# EAGLE design tailbrake (EAGLE 6.4)
LED tail/brake light replacement
Assembly variants: Simple, Dimmed
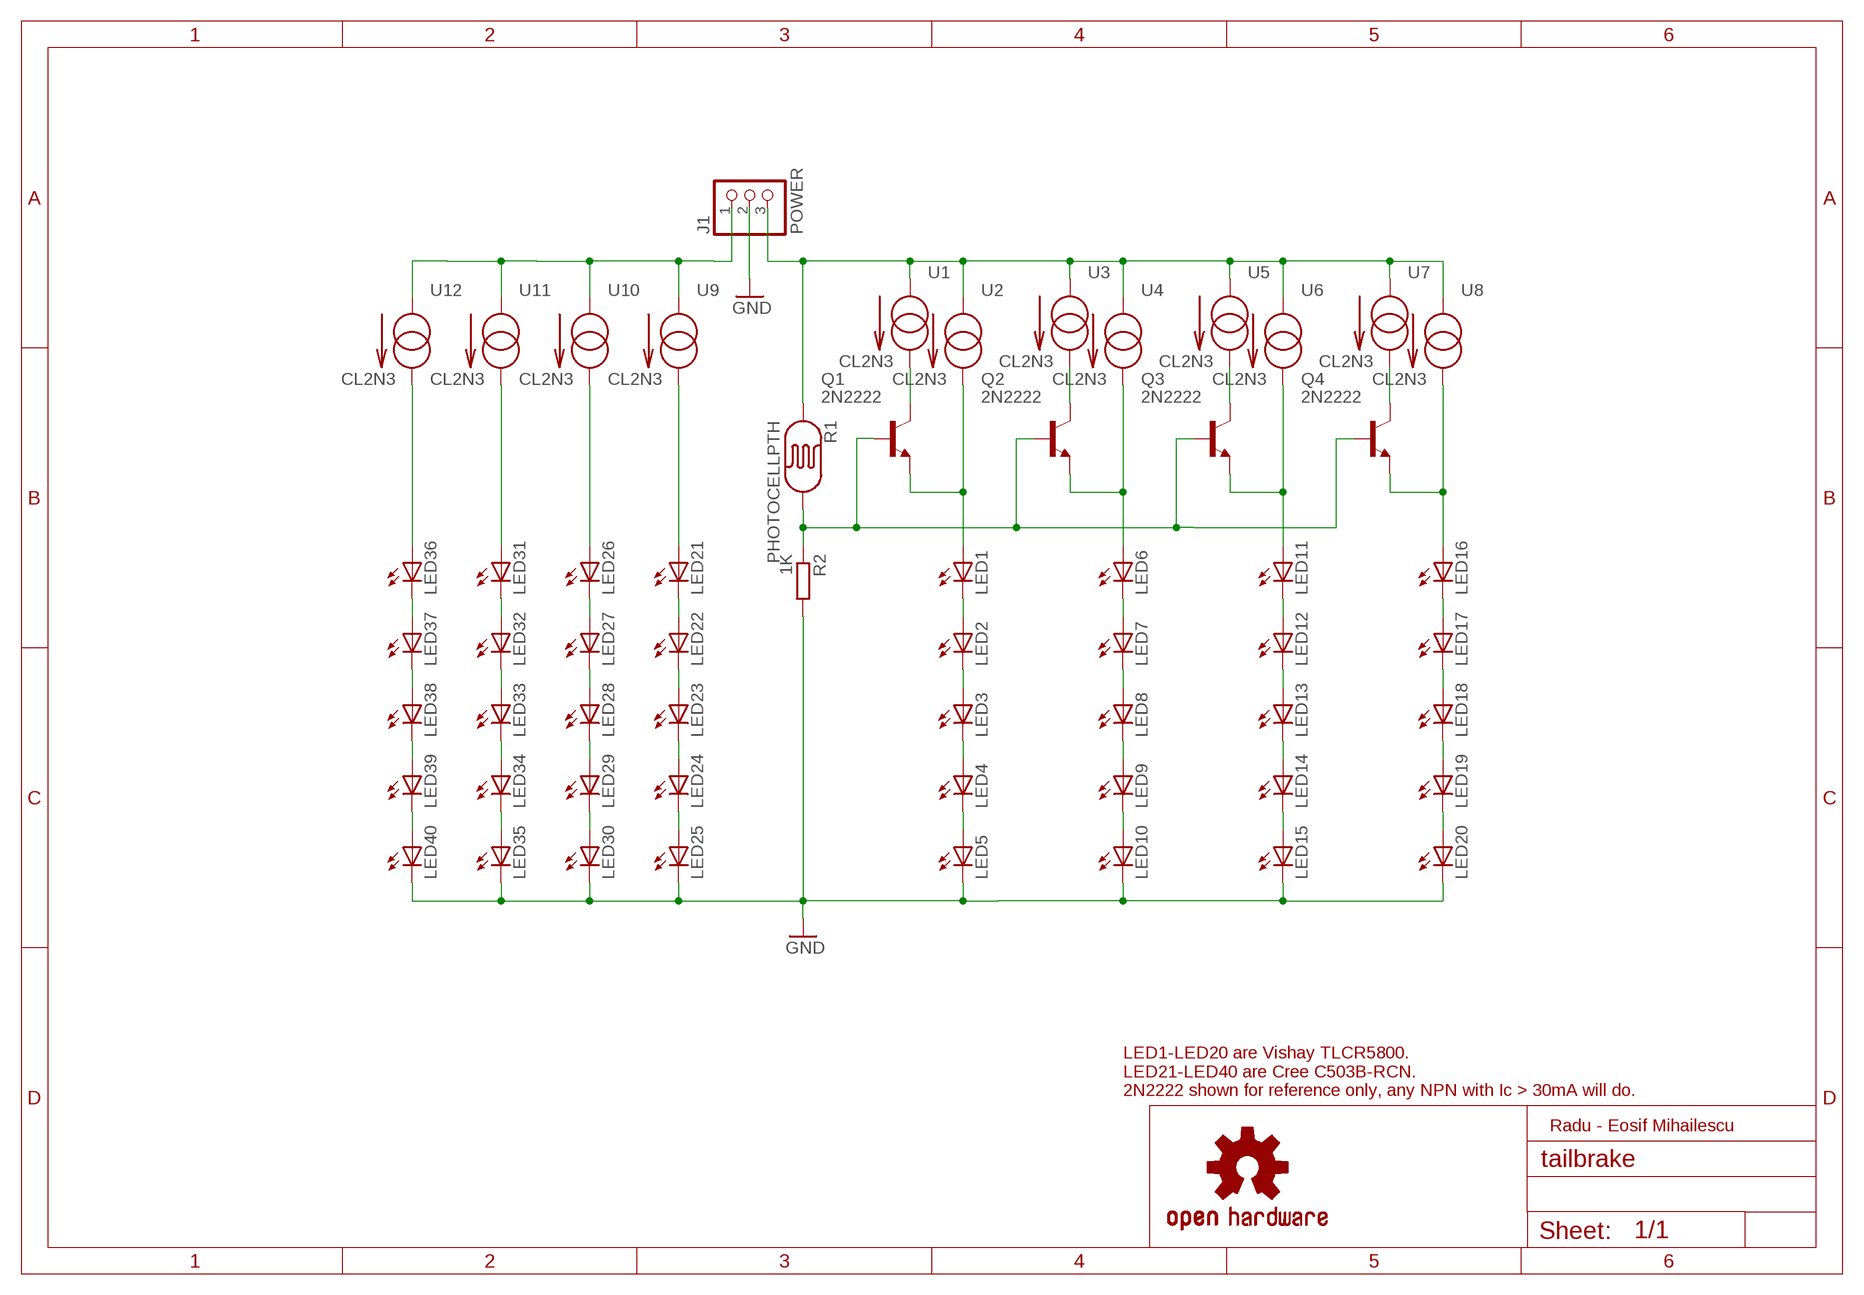
[diagram p0: schematic, sheet 1]

## Parts
J1  POWER  PINHD-1X3/90  [1X03/90]
LED1  LED5MM  [LED5MM]
LED2  LED5MM  [LED5MM]
LED3  LED5MM  [LED5MM]
LED4  LED5MM  [LED5MM]
LED5  LED5MM  [LED5MM]
LED6  LED5MM  [LED5MM]
LED7  LED5MM  [LED5MM]
LED8  LED5MM  [LED5MM]
LED9  LED5MM  [LED5MM]
LED10  LED5MM  [LED5MM]
LED11  LED5MM  [LED5MM]
LED12  LED5MM  [LED5MM]
LED13  LED5MM  [LED5MM]
LED14  LED5MM  [LED5MM]
LED15  LED5MM  [LED5MM]
LED16  LED5MM  [LED5MM]
LED17  LED5MM  [LED5MM]
LED18  LED5MM  [LED5MM]
LED19  LED5MM  [LED5MM]
LED20  LED5MM  [LED5MM]
LED21  LED5MM  [LED5MM]
LED22  LED5MM  [LED5MM]
LED23  LED5MM  [LED5MM]
LED24  LED5MM  [LED5MM]
LED25  LED5MM  [LED5MM]
LED26  LED5MM  [LED5MM]
LED27  LED5MM  [LED5MM]
LED28  LED5MM  [LED5MM]
LED29  LED5MM  [LED5MM]
LED30  LED5MM  [LED5MM]
LED31  LED5MM  [LED5MM]
LED32  LED5MM  [LED5MM]
LED33  LED5MM  [LED5MM]
LED34  LED5MM  [LED5MM]
LED35  LED5MM  [LED5MM]
LED36  LED5MM  [LED5MM]
LED37  LED5MM  [LED5MM]
LED38  LED5MM  [LED5MM]
LED39  LED5MM  [LED5MM]
LED40  LED5MM  [LED5MM]
LOGO1  OSHW-LOGOL  [OSHW-LOGO-L]
Q1  2N2222  2N2222-NPN-TO92-EBC  [TO92-EBC]  (not fitted in variant Simple)
Q2  2N2222  2N2222-NPN-TO92-EBC  [TO92-EBC]  (not fitted in variant Simple)
Q3  2N2222  2N2222-NPN-TO92-EBC  [TO92-EBC]  (not fitted in variant Simple)
Q4  2N2222  2N2222-NPN-TO92-EBC  [TO92-EBC]  (not fitted in variant Simple)
R1  PHOTOCELLPTH  [PHOTOCELL]  (not fitted in variant Simple)
R2  1K  R-EU_0204/7  [0204/7]  (not fitted in variant Simple)
U1  CL2N3  [TO-92]
U2  CL2N3  [TO-92]
U3  CL2N3  [TO-92]
U4  CL2N3  [TO-92]
U5  CL2N3  [TO-92]
U6  CL2N3  [TO-92]
U7  CL2N3  [TO-92]
U8  CL2N3  [TO-92]
U9  CL2N3  [TO-92]
U10  CL2N3  [TO-92]
U11  CL2N3  [TO-92]
U12  CL2N3  [TO-92]

## Nets
BRAKE [power]: J1.3 R1.1 U1.1(IN) U2.1(IN) U3.1(IN) U4.1(IN) U5.1(IN) U6.1(IN) U7.1(IN) U8.1(IN)
GND [power]: J1.2 LED5.K(C) LED10.K(C) LED15.K(C) LED20.K(C) LED25.K(C) LED30.K(C) LED35.K(C) LED40.K(C) R2.2
N$1 [power]: LED1.K(C) LED2.A
N$2 [power]: LED2.K(C) LED3.A
N$3 [power]: LED3.K(C) LED4.A
N$4 [power]: LED1.A Q1.E U2.3(OUT)
N$5 [power]: LED4.K(C) LED5.A
N$6 [power]: Q1.C U1.3(OUT)
N$7 [power]: Q2.C U3.3(OUT)
N$8 [power]: LED6.K(C) LED7.A
N$9 [power]: LED7.K(C) LED8.A
N$10 [power]: LED8.K(C) LED9.A
N$11 [power]: LED6.A Q2.E U4.3(OUT)
N$12 [power]: LED9.K(C) LED10.A
N$13 [power]: Q3.C U5.3(OUT)
N$14 [power]: LED11.K(C) LED12.A
N$15 [power]: LED12.K(C) LED13.A
N$16 [power]: LED13.K(C) LED14.A
N$17 [power]: LED11.A Q3.E U6.3(OUT)
N$18 [power]: LED14.K(C) LED15.A
N$19 [power]: LED16.K(C) LED17.A
N$20 [power]: LED17.K(C) LED18.A
N$21 [power]: LED18.K(C) LED19.A
N$22 [power]: LED16.A Q4.E U8.3(OUT)
N$23 [power]: LED19.K(C) LED20.A
N$24 [power]: Q4.C U7.3(OUT)
N$26 [power]: LED21.K(C) LED22.A
N$27 [power]: LED22.K(C) LED23.A
N$28 [power]: LED23.K(C) LED24.A
N$29 [power]: LED21.A U9.3(OUT)
N$30 [power]: LED24.K(C) LED25.A
N$31 [power]: LED26.K(C) LED27.A
N$32 [power]: LED27.K(C) LED28.A
N$33 [power]: LED28.K(C) LED29.A
N$34 [power]: LED26.A U10.3(OUT)
N$35 [power]: LED29.K(C) LED30.A
N$36 [power]: LED31.K(C) LED32.A
N$37 [power]: LED32.K(C) LED33.A
N$38 [power]: LED33.K(C) LED34.A
N$39 [power]: LED31.A U11.3(OUT)
N$40 [power]: LED34.K(C) LED35.A
N$41 [power]: LED36.K(C) LED37.A
N$42 [power]: LED37.K(C) LED38.A
N$43 [power]: LED38.K(C) LED39.A
N$44 [power]: LED36.A U12.3(OUT)
N$45 [power]: LED39.K(C) LED40.A
SENSE [signal]: Q1.B Q2.B Q3.B Q4.B R1.2 R2.1
TAIL [power]: J1.1 U9.1(IN) U10.1(IN) U11.1(IN) U12.1(IN)

## Notes on the sheet
- LED1-LED20 are Vishay TLCR5800.
  LED21-LED40 are Cree C503B-RCN.
  2N2222 shown for reference only, any NPN with Ic > 30mA will do.
- Radu - Eosif Mihailescu

## Library data of the parts
J1 = pinhead:PINHD-1X3: PIN HEADER
LED1-LED40 = led:LED: LED OSRAM: - CHIPLED LG R971, LG N971, LY N971, LG Q971, LY Q971, LO R971, LY R971 LH N974, LH R974 LS Q976, LO Q976, LY Q976 LO Q996 - Hyper CHIPLED LW Q18S LB Q993, LB Q99A, LB R99A - SideLED LS A670, LO A670, LY A670, LG A670, LP A670 LB A673, LV A673, LT A673, LW A673 LH A674 LY A675 LS A676, LA A676, LO A676, LY A676, LW A676 LS A679, LY A679, LG A679 - Hyper Micro SIDELED® LS Y876, LA Y876, LO Y876, LY Y876 LT Y87S - SmartLED LW L88C, LW L88S LB L89C, LB L89S, LG L890 LS L89K, LO L89K, LY L89K LS L896, LA L896, LO L896, LY L896 - TOPLED LS T670, LO T670, LY T670, LG T670, LP T670 LSG T670, LSP T670, LSY T670, LOP T670, LYG T670 LG T671, LOG T671, LSG T671 LB T673, LV T673, LT T673, LW T673 LH T674 LS T676, LA T676, LO T676, LY T676, LB T676, LH T676, LSB T676, LW T676 LB T67C, LV T67C, LT T67C, LS T67K, LO T67K, LY T67K, LW E67C LS E67B, LA E67B, LO E67B, LY E67B, LB E67C, LV E67C, LT E67C LW T67C LS T679, LY T679, LG T679 LS T770, LO T770, LY T770, LG T770, LP T770 LB T773, LV T773, LT T773, LW T773 LH T774 LS E675, LA E675, LY E675, LS T675 LS T776, LA T776, LO T776, LY T776, LB T776 LHGB T686 LT T68C, LB T68C - Hyper Mini TOPLED® LB M676 - Mini TOPLED Santana® LG M470 LS M47K, LO M47K, LY M47K Source: http://www.osram.convergy.de LUXEON: - LUMILED® LXK2-PW12-R00, LXK2-PW12-S00, LXK2-PW14-U00, LXK2-PW14-V00 LXK2-PM12-R00, LXK2-PM12-S00, LXK2-PM14-U00 LXK2-PE12-Q00, LXK2-PE12-R00, LXK2-PE12-S00, LXK2-PE14-T00, LXK2-PE14-U00 LXK2-PB12-K00, LXK2-PB12-L00, LXK2-PB12-M00, LXK2-PB14-N00, LXK2-PB14-P00, LXK2-PB14-Q00 LXK2-PR12-L00, LXK2-PR12-M00, LXK2-PR14-Q00, LXK2-PR14-R00 LXK2-PD12-Q00, LXK2-PD12-R00, LXK2-PD12-S00 LXK2-PH12-R00, LXK2-PH12-S00 LXK2-PL12-P00, LXK2-PL12-Q00, LXK2-PL12-R00 Source: www.luxeon.com KINGBRIGHT: KA-3528ASYC Source: www.kingbright.com
LOGO1 = SparkFun-Aesthetics:OSHW-LOGO: Open Source Hardware Logo This logo indicates the piece of hardware it is found on incorporates a OSHW license and/or adheres to the definition of open source hardware found here: http://freedomdefined.org/OSHW
Q1-Q4 = transistor-neu-to92:*-NPN-: NPN Transistror
R1 = SparkFun-Sensors:PHOTOCELL: CdS photoresistor. This is a low cost way to detect light levels. Resistance decreases with more incoming light. SparkFun SKU: SEN-09088
R2 = rcl:R-EU_: RESISTOR, European symbol
U1-U12 = radu-collected:CL2*: Supertex CL2 20mA thermocompensated constant current source for driving LEDs

## Net classes
0 default: clearance 0.355 mm
1 power: width 1.27 mm, clearance 0.508 mm
2 signal: width 0.254 mm, clearance 0.254 mm

## Board
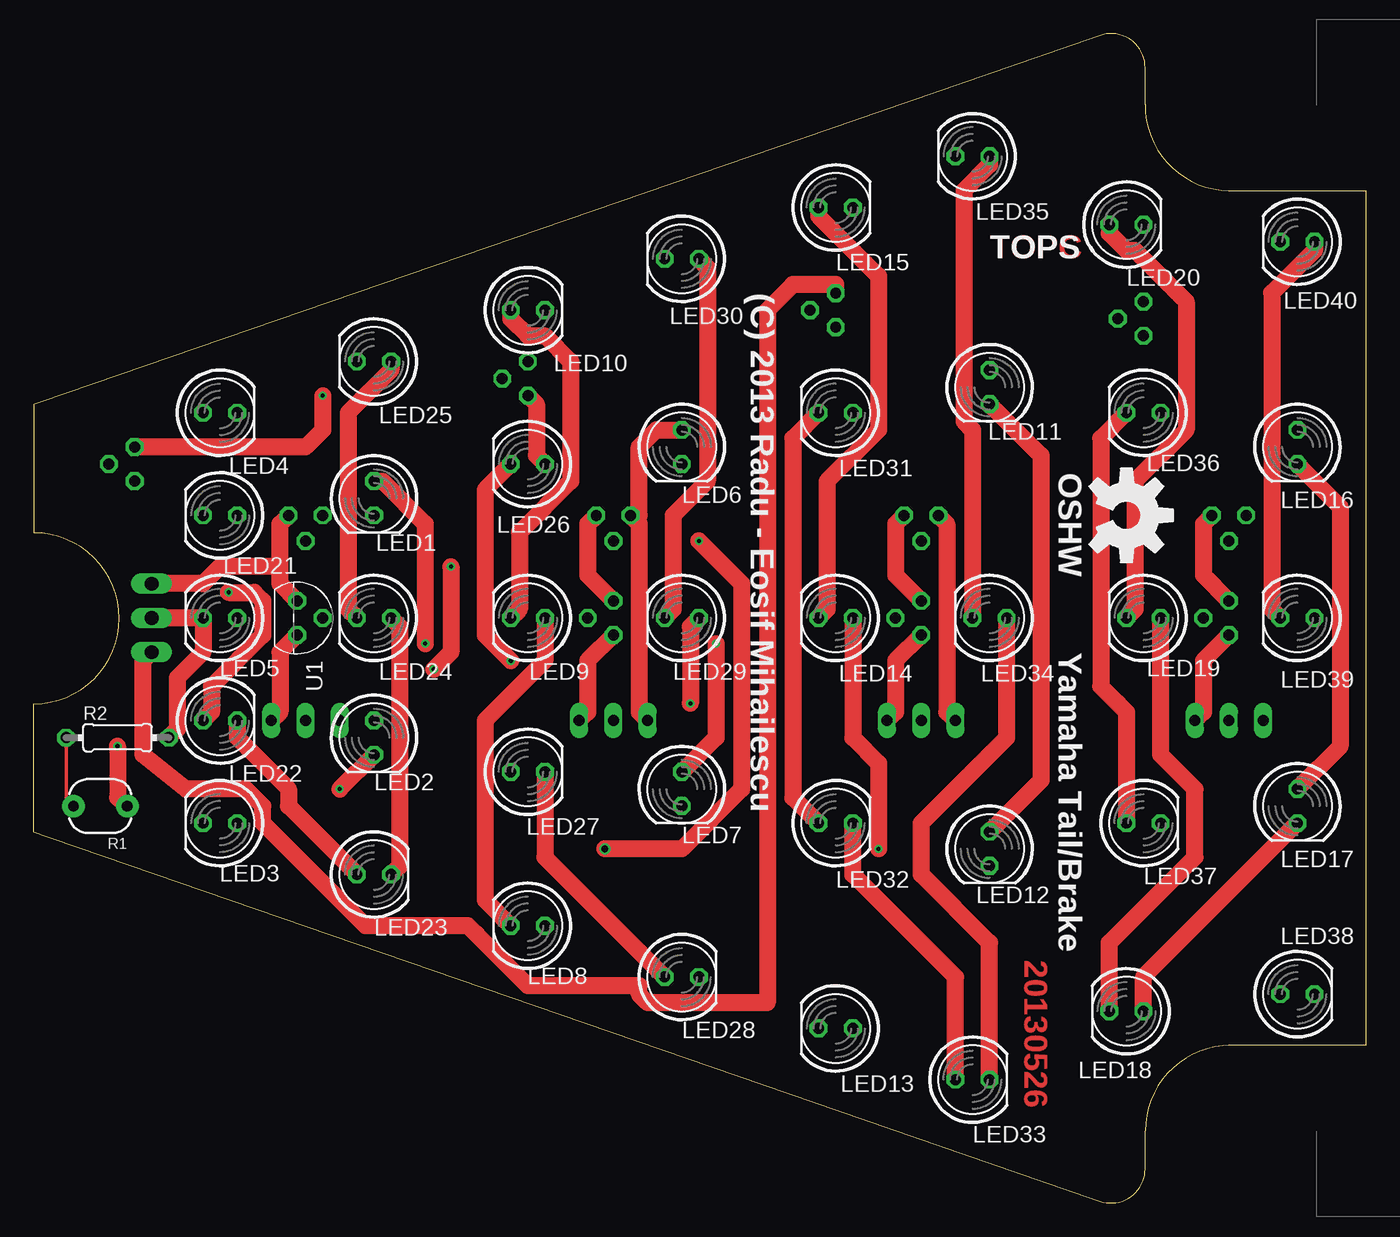
[diagram p1: board, top side]
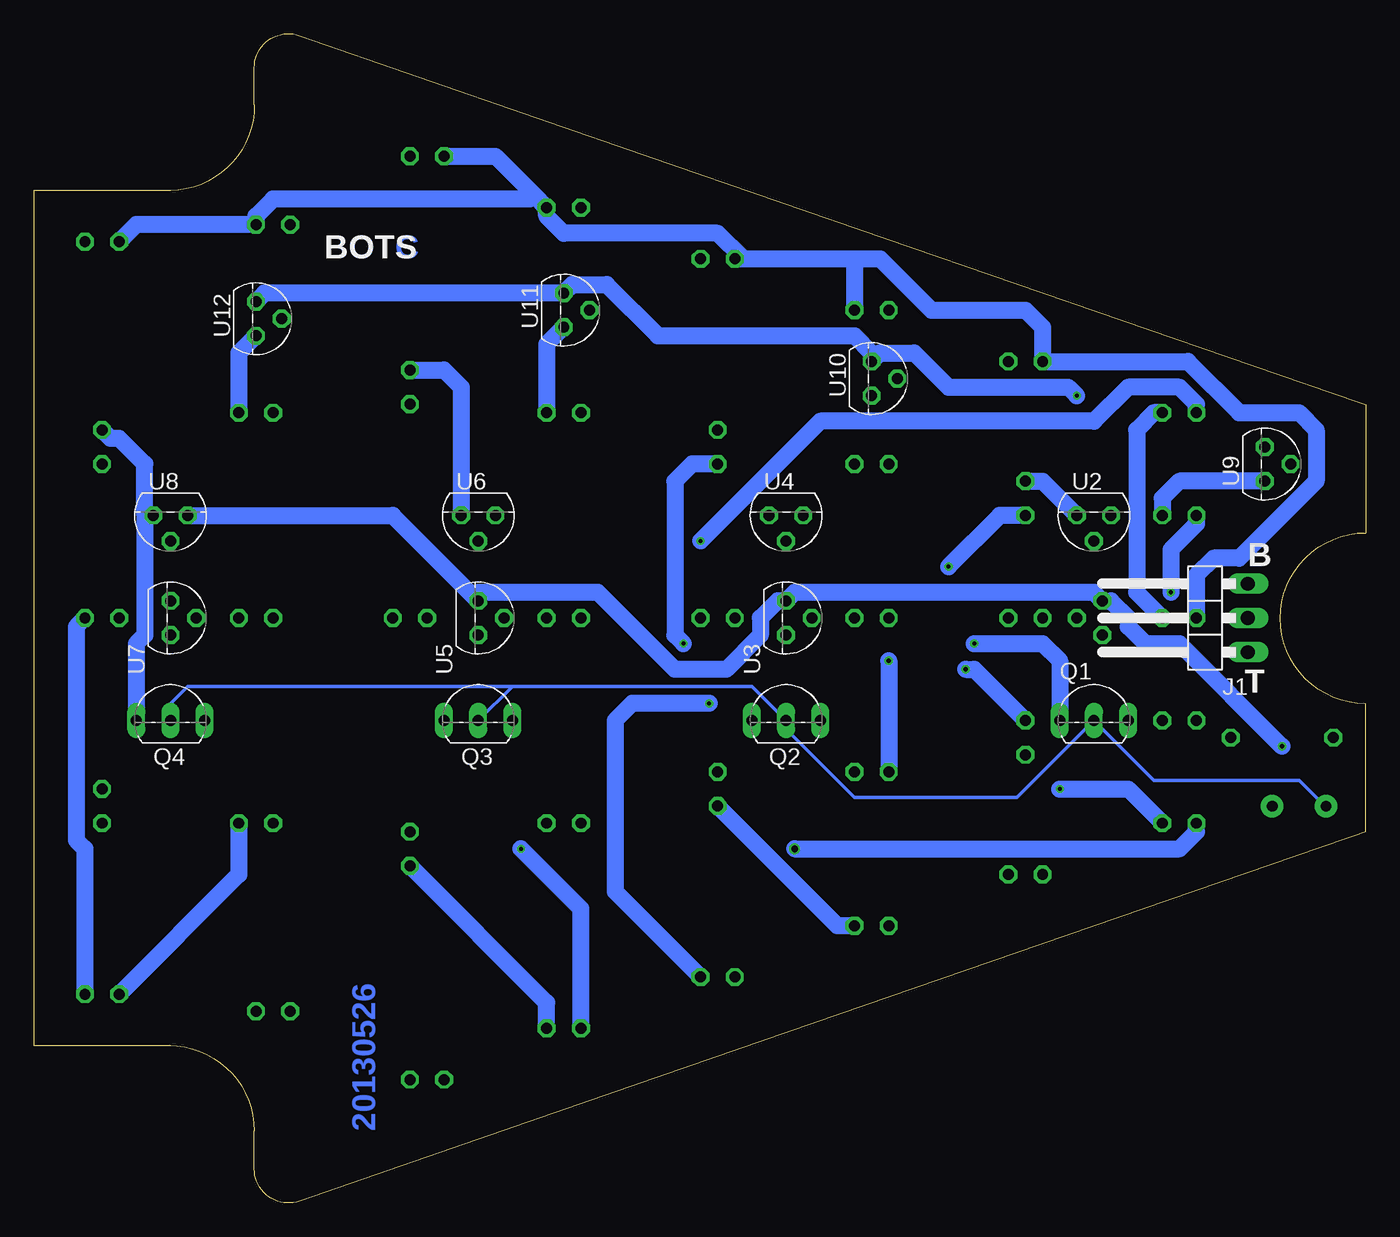
[diagram p2: board, bottom side, seen from below]

Size 98.93 x 86.84 mm. Coordinates in mm from the lower left corner, seen from the top.
Outline: 88.9,11.7 arc90 82.55,5.35 82.55,2.54 arc-109 79.18,0.14 0,27.55 0,37.07 arc180 0,49.77 0,59.3 79.18,86.7 arc-109 82.55,84.3 82.55,81.55 arc90 88.77,75.2 98.93,75.2 98.93,11.7 88.9,11.7
Outline: 88.9,11.7 88.77,11.7
Copper layers (1*16): Top 0.035mm / dielectric 1.5mm / Bottom 0.035mm
Design rules "ITEADstudio_DRC": minimum track width 10mil, minimum drill 12mil, track to track 10mil, track to pad 10mil, pad to pad 10mil, via to via 10mil, smd to smd 0mil, copper to edge 20mil, drill to drill 10mil, minimum pad ring 10mil, minimum via ring 6mil, stop-mask expansion 4mil, vias tented up to drill 100mil, thermal gap 10mil

### Footprints (pad centres in the part's own frame; a part is rotated, then mirrored left to right if it is on the bottom)
1X03/90 = drill 1.016 long: 1 -2.54,-3.81; 2 0,-3.81; 3 2.54,-3.81
LED5MM = drill 0.813 octagon: A -1.27,0; K 1.27,0
TO92-EBC = drill 0.813 long: B 0,-1.27; C 2.54,-1.27; E -2.54,-1.27
PHOTOCELL = drill 0.8 pad 1.676: 1 -2,0; 2 2,0
0204/7 = drill 0.813 octagon: 1 -3.81,0; 2 3.81,0
TO-92 = drill 0.813 octagon: 1 -1.27,0; 2 0,1.905; 3 1.27,0

### Placement (x,y rotation side)
J1  12.57,43.45 90 bottom
LED1  25.27,52.34 270 top
LED2  25.27,34.56 270 top
LED3  13.84,28.21 180 top
LED4  13.84,58.69 0 top
LED5  13.84,43.45 180 top
LED6  48.13,56.15 270 top
LED7  48.13,30.75 270 top
LED8  36.7,20.59 180 top
LED9  36.7,43.45 180 top
LED10  36.7,66.31 0 top
LED11  70.99,60.59 270 top
LED12  70.99,26.3 270 top
LED13  59.56,12.97 180 top
LED14  59.56,43.45 180 top
LED15  59.56,73.93 0 top
LED16  93.85,56.15 270 top
LED17  93.85,29.48 270 top
LED18  81.15,14.24 180 top
LED19  82.42,43.45 180 top
LED20  81.15,72.66 0 top
LED21  13.84,51.07 180 top
LED22  13.84,35.83 0 top
LED23  25.27,24.4 0 top
LED24  25.27,43.45 180 top
LED25  25.27,62.5 180 top
LED26  36.7,54.88 180 top
LED27  36.7,32.02 0 top
LED28  48.13,16.78 0 top
LED29  48.13,43.45 180 top
LED30  48.13,70.12 180 top
LED31  59.56,58.69 180 top
LED32  59.56,28.21 0 top
LED33  69.72,9.16 0 top
LED34  70.99,43.45 180 top
LED35  69.72,77.74 180 top
LED36  82.42,58.69 180 top
LED37  82.42,28.21 0 top
LED38  93.85,15.51 0 top
LED39  93.85,43.45 180 top
LED40  93.85,71.39 180 top
LOGO1  81.15,51.07 270 top
Q1  20.19,37.1 0 bottom
Q2  43.05,37.1 0 bottom
Q3  65.91,37.1 0 bottom
Q4  88.77,37.1 0 bottom
R1  4.95,29.48 180 top
R2  6.22,34.56 0 top
U1  19.56,43.45 270 top
U2  20.19,51.07 180 bottom
U3  43.05,43.45 270 bottom
U4  43.05,51.07 180 bottom
U5  65.91,43.45 270 bottom
U6  65.91,51.07 180 bottom
U7  88.77,43.45 270 bottom
U8  88.77,51.07 180 bottom
U9  7.49,54.88 270 bottom
U10  36.7,61.23 270 bottom
U11  59.56,66.31 270 bottom
U12  82.42,65.67 270 bottom

### Tracks (layer width: path | path; a pad name or v marks a point on that pad's centre or on a via)
BRAKE  (via drill 0.3)
  Top 1.27: U5.1 64.01,46.62 64.01,50.43 U6.1 | U7.1 86.87,46.62 86.87,50.43 U8.1 | U3.1 41.15,46.62 41.15,50.43 U4.1 | U2.1 18.29,50.43 18.29,47.26 | 18.29,47.26 18.29,45.99 U1.1 | J1.3 12.57,45.99 13.84,47.26 18.29,47.26 | v6.22,33.92 6.22,30.11 6.86,29.48 R1.1
  Bottom 1.27: U8.1 72.26,51.07 U5.1 65.91,45.35 57.02,45.35 51.31,39.64 47.5,39.64 44.96,42.18 44.96,43.45 43.69,44.72 U3.1 42.42,45.35 20.19,45.35 U1.1 18.92,44.72 17.65,43.45 17.65,42.81 16.38,41.54 13.84,41.54 v6.22,33.92
GND
  Top 1.27: R2.2 10.67,35.19 10.67,39 12.57,40.91 LED5.K J1.2
  Bottom 1.27: LED40.K 91.31,72.66 LED20.K 82.42,73.29 81.15,74.56 62.1,74.56 61.79,74.88 | 61.79,74.88 64.64,77.74 LED35.K | 61.79,74.88 LED15.K 60.83,73.29 59.56,72.02 48.13,72.02 46.23,70.12 | 46.23,70.12 LED30.K 46.23,70.12 | 46.23,70.12 37.97,70.12 | 37.97,70.12 36.07,70.12 32.26,66.31 25.27,66.31 24,65.04 LED25.K 13.21,62.5 9.4,58.69 4.95,58.69 3.68,57.42 3.68,53.61 9.4,47.89 11.3,47.89 12.57,46.62 LED5.K | 37.97,70.12 LED10.K
N$1  (via drill 0.3)
  Top 1.27: v29.72,39.64 30.99,40.91 v30.99,47.26
  Bottom 1.27: LED2.A 29.08,39.64 v29.72,39.64 | v30.99,47.26 27.18,51.07 LED1.K
N$2  (via drill 0.3)
  Top 1.27: LED2.K v22.73,30.75
  Bottom 1.27: LED3.A 17.65,30.75 v22.73,30.75
N$3  (via drill 0.3, 0.51)
  Top 1.27: v42.42,26.3 48.13,26.3 52.58,30.75 52.58,45.99 v49.4,49.16
  Bottom 1.27: v42.42,26.3 13.84,26.3 12.57,27.57 LED3.K | v49.4,49.16 40.51,58.05 20.19,58.05 17.65,60.59 13.84,60.59 12.57,59.32 LED4.A
N$4  (via drill 0.3)
  Top 1.27: v29.08,41.54 29.08,50.43 25.91,53.61 LED1.A
  Bottom 1.27: v29.08,41.54 24,41.54 22.73,40.27 Q1.E | U2.3 24,53.61 LED1.A
N$5
  Bottom 1.27: LED5.A 17.02,45.35 17.02,57.42 15.75,58.69 LED4.K
N$6
  Top 1.27: Q1.C 18.29,36.46 18.29,40.91 U1.3
N$7
  Top 1.27: Q2.C 41.15,36.46 41.15,40.27 U3.3
N$8  (via drill 0.3)
  Top 1.27: LED7.A 50.67,34.56 v50.67,41.54
  Bottom 1.27: v50.67,41.54 51.31,42.18 51.31,53.61 50.04,54.88 LED6.K
N$9
  Bottom 1.27: LED8.A 39.24,20.59 LED7.K
N$10
  Top 1.27: LED8.K 33.53,22.49 33.53,35.83 37.97,40.27 LED9.A
N$11
  Top 1.27: Q2.E 44.96,36.46 44.96,50.43 U4.3 44.96,51.07 44.96,56.15 46.23,57.42 LED6.A
N$12
  Top 1.27: LED9.K 36.07,44.08 36.07,49.8 39.88,53.61 39.88,62.5 37.97,64.4 36.7,64.4 35.43,65.67 LED10.A
N$13
  Top 1.27: Q3.C 64.01,36.46 64.01,40.27 U5.3
N$14
  Top 1.27: LED11.K 74.8,55.51 74.8,31.38 LED12.A
N$15
  Bottom 1.27: LED13.A 60.83,14.87 LED12.K
N$16  (via drill 0.3)
  Top 1.27: v62.74,26.3 62.74,32.65 60.83,34.56 LED14.A
  Bottom 1.27: LED13.K 58.29,21.86 v62.74,26.3
N$17
  Top 1.27: Q3.E 67.82,36.46 67.82,50.43 U6.3
  Bottom 1.27: LED11.A 68.45,61.86 67.18,60.59 U6.3
N$18
  Top 1.27: LED14.K 58.93,44.08 58.93,53.61 62.74,57.42 62.74,68.85 58.29,73.29 LED15.A
N$19
  Top 1.27: LED17.A 97.03,33.92 97.03,51.7 LED16.K
N$20
  Top 1.27: LED18.A 82.42,16.78 LED17.K
N$21
  Top 1.27: LED18.K 79.88,19.32 86.23,25.67 86.23,30.75 83.69,33.29 LED19.A
N$22
  Bottom 1.27: Q4.E 91.31,41.54 90.68,42.18 90.68,51.07 | 90.68,51.07 U8.3 90.68,51.07 | LED16.A 93.22,56.78 92.58,56.78 90.68,54.88 90.68,51.07
N$23
  Top 1.27: LED19.K 81.79,44.08 81.79,53.61 85.6,57.42 85.6,66.94 81.79,70.75 81.15,70.75 79.88,72.02 LED20.A
N$24
  Top 1.27: Q4.C 86.87,36.46 86.87,40.27 U7.3
N$26  (via drill 0.3)
  Top 1.27: LED22.A 13.21,36.46 13.21,38.37 17.02,42.18 17.02,44.72 16.38,45.35 v14.48,45.35
  Bottom 1.27: v14.48,45.35 14.48,48.53 13.84,49.16 12.57,50.43 LED21.K
N$27
  Top 1.27: LED23.A 18.92,29.48 18.92,30.75 15.11,34.56 LED22.K
N$28
  Top 1.27: LED23.K 27.18,25.03 27.18,42.81 LED24.A
N$29
  Bottom 1.27: U9.3 13.84,53.61 15.11,52.34 LED21.A
N$30
  Top 1.27: LED24.K 23.37,44.08 23.37,58.69 26.54,61.86 LED25.A
N$31  (via drill 0.3)
  Top 1.27: v35.43,40.27 33.53,42.18 33.53,52.97 LED26.K
  Bottom 1.27: v35.43,40.27 LED27.A
N$32
  Top 1.27: LED28.A 37.97,25.67 LED27.K
N$33  (via drill 0.3)
  Top 1.27: v48.77,37.1 48.77,42.81 LED29.A
  Bottom 1.27: LED28.K 55.75,23.13 55.75,35.83 54.48,37.1 v48.77,37.1
N$34
  Top 1.27: LED26.A 37.34,55.51 37.34,59.32 U10.3
N$35
  Top 1.27: LED29.K 47.5,44.08 47.5,51.07 50.04,53.61 50.04,69.48 LED30.A
N$36
  Top 1.27: LED32.A 56.39,30.11 56.39,56.78 LED31.K
N$37
  Top 1.27: LED33.A 68.45,16.78 60.83,24.4 LED32.K
N$38
  Top 1.27: LED33.K 70.99,19.32 65.91,24.4 65.91,28.21 72.26,34.56 LED34.A
N$39
  Bottom 1.27: U11.3 60.83,63.77 LED31.A
N$40
  Top 1.27: LED34.K 69.72,57.42 69.09,58.05 69.09,75.2 70.99,77.1 LED35.A
N$41
  Top 1.27: LED37.A 81.15,36.46 80.52,37.1 79.25,38.37 79.25,56.78 LED36.K
N$42
  Bottom 1.27: LED38.A 83.69,24.4 LED37.K
N$43
  Bottom 1.27: LED38.K 95.12,26.3 95.76,26.94 95.76,42.81 LED39.A
N$44
  Bottom 1.27: U12.3 83.69,63.13 LED36.A
N$45
  Top 1.27: LED39.K 91.95,44.08 91.95,67.58 95.12,70.75 LED40.A
SENSE
  Top 0.254: R2.1 2.41,29.48 R1.2
  Bottom 0.254: R1.2 3.05,29.48 4.95,31.38 15.75,31.38 Q1.B 25.91,30.11 37.97,30.11 43.05,35.19 Q2.B 45.59,38.37 63.37,38.37 | Q3.B 63.37,38.37 | Q4.B 88.77,37.1 87.5,38.37 76.07,38.37 69.09,38.37 63.37,38.37
TAIL  (via drill 0.3)
  Top 1.27: v21.46,59.96 21.46,57.42 20.19,56.15 U9.1 | J1.1 8.13,40.27 8.13,33.29 11.3,30.75 15.75,30.75 17.02,29.48 17.02,28.21 24.64,20.59 32.26,20.59 32.89,19.95 36.7,16.14 44.96,16.14 44.96,15.51 45.59,14.87 54.48,14.87 54.48,66.31 56.39,68.21 59.56,68.21 U11.1
  Bottom 1.27: v21.46,59.96 22.1,60.59 30.99,60.59 33.53,63.13 36.07,63.13 U10.1 36.7,63.13 37.97,64.4 52.58,64.4 56.39,68.21 58.93,68.21 U11.1 81.79,67.58 U12.1

### Text on the board
Top: TOPC | 20130526
Bottom: BOTC | 20130526
tPlace: TOPS | (C) 2013 Radu - Eosif Mihailescu | OSHW | Yamaha Tail/Brake
bPlace: BOTS | B | T